# EAGLE schematic testv2 (EAGLE 6.3)
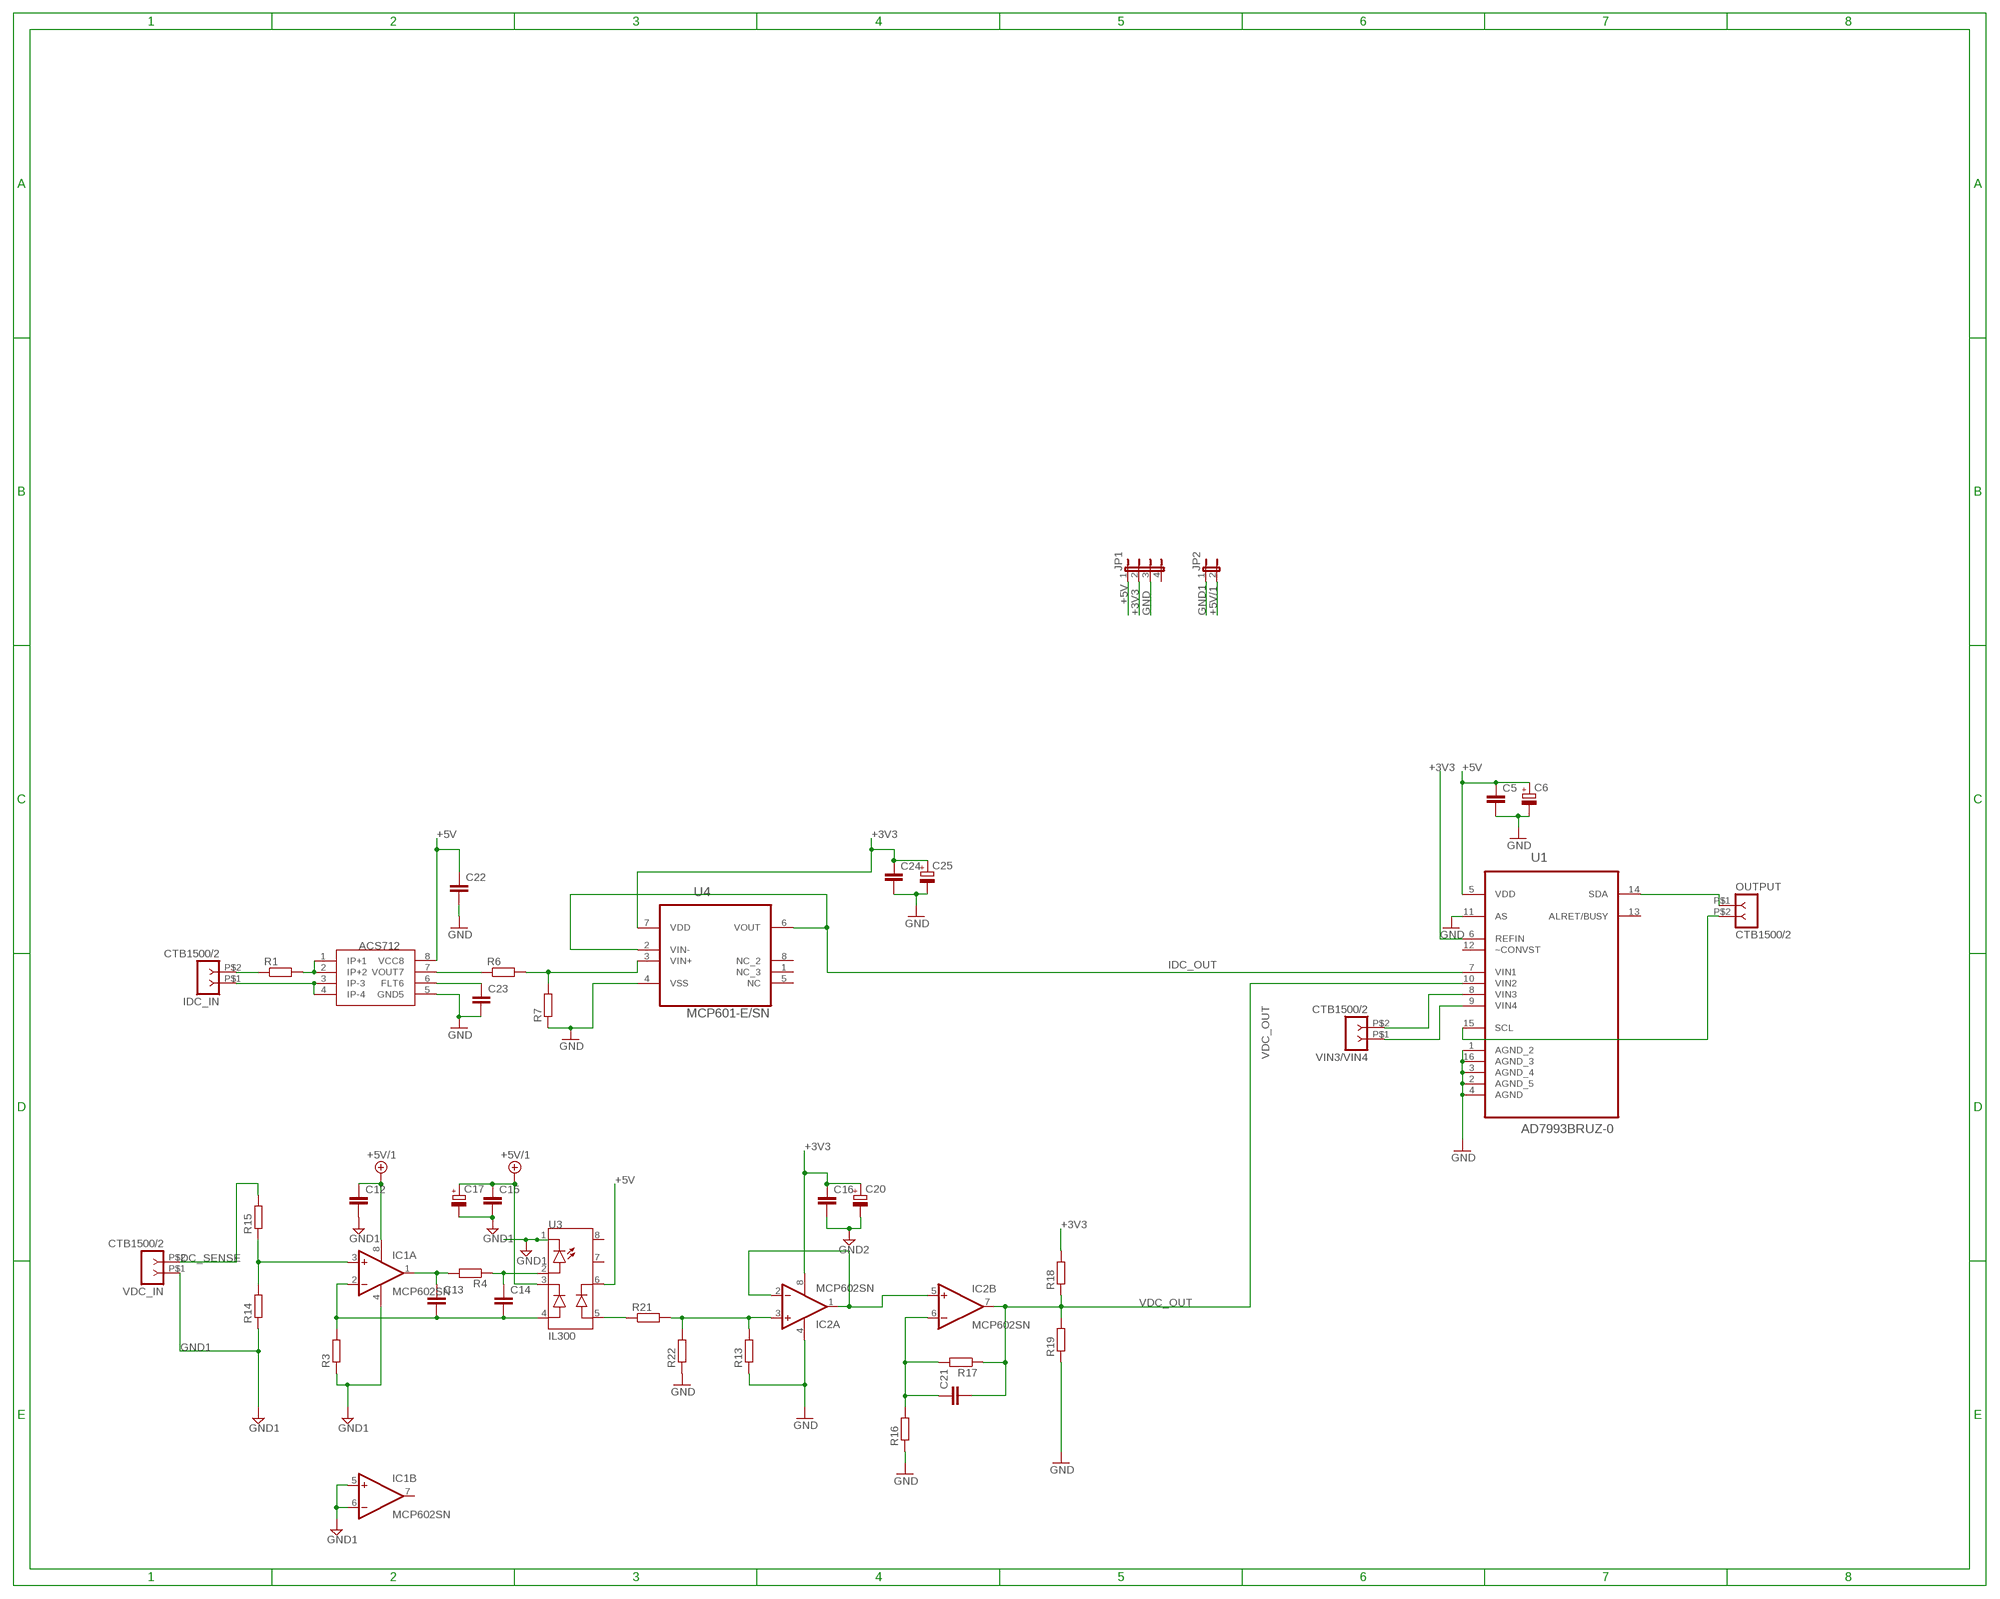
[diagram p0: schematic, sheet 1]

## Parts
C5  C-EU025-025X050  [C025-025X050]
C6  CPOL-EUE2-4  [E2-4]
C12  C-EU025-025X050  [C025-025X050]
C13  C-EU025-025X050  [C025-025X050]
C14  C-EU025-025X050  [C025-025X050]
C15  C-EU025-025X050  [C025-025X050]
C16  C-EU025-025X050  [C025-025X050]
C17  CPOL-EUE2-4  [E2-4]
C20  CPOL-EUE2-4  [E2-4]
C21  C-EU025-025X050  [C025-025X050]
C22  C-EU025-025X050  [C025-025X050]
C23  C-EU025-025X050  [C025-025X050]
C24  C-EU025-025X050  [C025-025X050]
C25  CPOL-EUE2-4  [E2-4]
IC1  MCP602SN  [SO08]
IC2  MCP602SN  [SO08]
IDC_IN  CTB1500/2  [CTB1500-2]
JP1  JP4E  [JP4]
JP2  JP1E  [JP1]
OUTPUT  CTB1500/2  [CTB1500-2]
R1  R-EU_0207/7  [0207/7]
R3  R-EU_0207/7  [0207/7]
R4  R-EU_0207/7  [0207/7]
R6  R-EU_0207/7  [0207/7]
R7  R-EU_0207/7  [0207/7]
R13  R-EU_0207/7  [0207/7]
R14  R-EU_0207/7  [0207/7]
R15  R-EU_0207/7  [0207/7]
R16  R-EU_0207/7  [0207/7]
R17  R-EU_0207/7  [0207/7]
R18  R-EU_0207/7  [0207/7]
R19  R-EU_0207/7  [0207/7]
R21  R-EU_0207/7  [0207/7]
R22  R-EU_0207/7  [0207/7]
U1  AD7993BRUZ-0  [SOP65P640X120-16N]
U3  IL300  [SO8]
U4  MCP601-E/SN  [SOIC127P600X175-8N]
U$10  ACS712  [SOIC8]
VDC_IN  CTB1500/2  [CTB1500-2]
VIN3/VIN4  CTB1500/2  [CTB1500-2]

## Nets
+3V3: C16.1 C20.+ C24.1 C25.+ IC2.8(P:V+) JP1.2 R18.2 U1.6(REFIN) U4.7(VDD)
+5V: C5.1 C6.+ C22.1 JP1.1 U1.5(VDD) U3.6(C_OUT) U$10.8(VCC8)
+5V/1: C12.1 C15.1 C17.+ IC1.8(P:V+) JP2.2 U3.3(C_FB)
DC_SENSE: R15.2 VDC_IN.P$2
GND: C5.2 C6.- C22.2 C23.2 C24.2 C25.- IC2.4(P:V-) JP1.3 R7.1 R13.1 R16.1 R19.1 R22.1 U1.1(AGND_2) U1.2(AGND_5) U1.3(AGND_4) U1.4(AGND) U1.11(AS) U1.16(AGND_3) U4.4(VSS) U$10.5(GND5)
GND1: C12.2 C15.2 C17.- IC1.4(P:V-) IC1.5(B:+IN) IC1.6(B:-IN) JP2.1 R3.1 R14.1 U3.1(C_LED) VDC_IN.P$1
GND2: C16.2 C20.-
IDC_OUT: U1.7(VIN1) U4.2(VIN-) U4.6(VOUT)
N$1: U1.9(VIN4) VIN3/VIN4.P$1
N$2: U1.8(VIN3) VIN3/VIN4.P$2
N$3: IDC_IN.P$2 R1.1
N$5: C13.2 C14.2 IC1.2(A:-IN) R3.2 U3.4(A_FB)
N$7: C14.1 R4.1 U3.2(A_LED)
N$8: R1.2 U$10.1(IP+1) U$10.2(IP+2)
N$9: C13.1 IC1.1(A:OUT) R4.2
N$14: IC2.3(A:+IN) R13.2 R21.2 R22.2
N$15: R21.1 U3.5(A_OUT)
N$20: IC2.1(A:OUT) IC2.2(A:-IN) IC2.5(B:+IN)
N$22: C21.1 IC2.6(B:-IN) R16.2 R17.2
N$25: IC1.3(A:+IN) R14.2 R15.1
N$26: IDC_IN.P$1 U$10.3(IP-3) U$10.4(IP-4)
N$27: R6.1 U$10.7(VOUT7)
N$28: C23.1 U$10.6(FLT6)
N$29: R6.2 R7.2 U4.3(VIN+)
N$30: OUTPUT.P$1 U1.14(SDA)
SCL: OUTPUT.P$2 U1.15(SCL)
VDC_OUT: C21.2 IC2.7(B:OUT) R17.1 R18.1 R19.2 U1.10(VIN2)
Unconnected: IC1.7(B:OUT) JP1.4 U1.12(~CONVST) U1.13(ALRET/BUSY) U3.7(PIN7) U3.8(PIN8) U4.1(NC_3) U4.5(NC) U4.8(NC_2)

## Library data of the parts
C5 C12-C16 C21-C24 = resistor:C-EU: CAPACITOR, European symbol
C6 C17 C20 C25 = resistor:CPOL-EU: POLARIZED CAPACITOR, European symbol
IC1 IC2 = linear:MCP602: Single Op Amp 2.7V to 6.0V Single Supply CMOS Source: http://ww1.microchip.com/downloads/en/DeviceDoc/21314g.pdf
IDC_IN OUTPUT VDC_IN VIN3/VIN4 = eko-parts:CTB1500/2
JP1 = jumper:JP4E: JUMPER
JP2 = jumper:JP1E: JUMPER
R1 R3 R4 R6 R7 R13-R19 R21 R22 = resistor:R-EU_: RESISTOR, European symbol
U1 = ADC:AD7993BRUZ-0: ADC; MPN: AD7993BRUZ-0; OC_FARNELL: 1078309; OC_NEWARK: 59K6101; PACKAGE: TSSOP-16; SUPPLIER: Analog Devices
U3 = eko-parts:IL300
U4 = mcp:MCP601-E/SN: IC, 2.7V to 5.5V Single-Supply CMOS Single Op Amps,SOIC-8; MPN: MCP601-E/SN; OC_FARNELL: 1852039; OC_NEWARK: 88H9865; PACKAGE: SOIC-8; SUPPLIER: Microchip
U$10 = Pauls_parts:ACS712